# Altium schematic sheet jetson_nano_breakout.SchDoc: CAN Bus HAT
size B; Date: 12/22/2022; Author: Cole Tucker; Organization: ORGANIZATION; Address1: ADDRESS 1; Address2: ADDRESS 2; Address3: ADDRESS 3; Address4: ADDRESS 4; Revision: -; SheetNumber: 1; SheetTotal: 1; ENG_APP_DATE: --/--/--; DSN_APP_DATE: --/--/--; CHK_APP_DATE: --/--/--
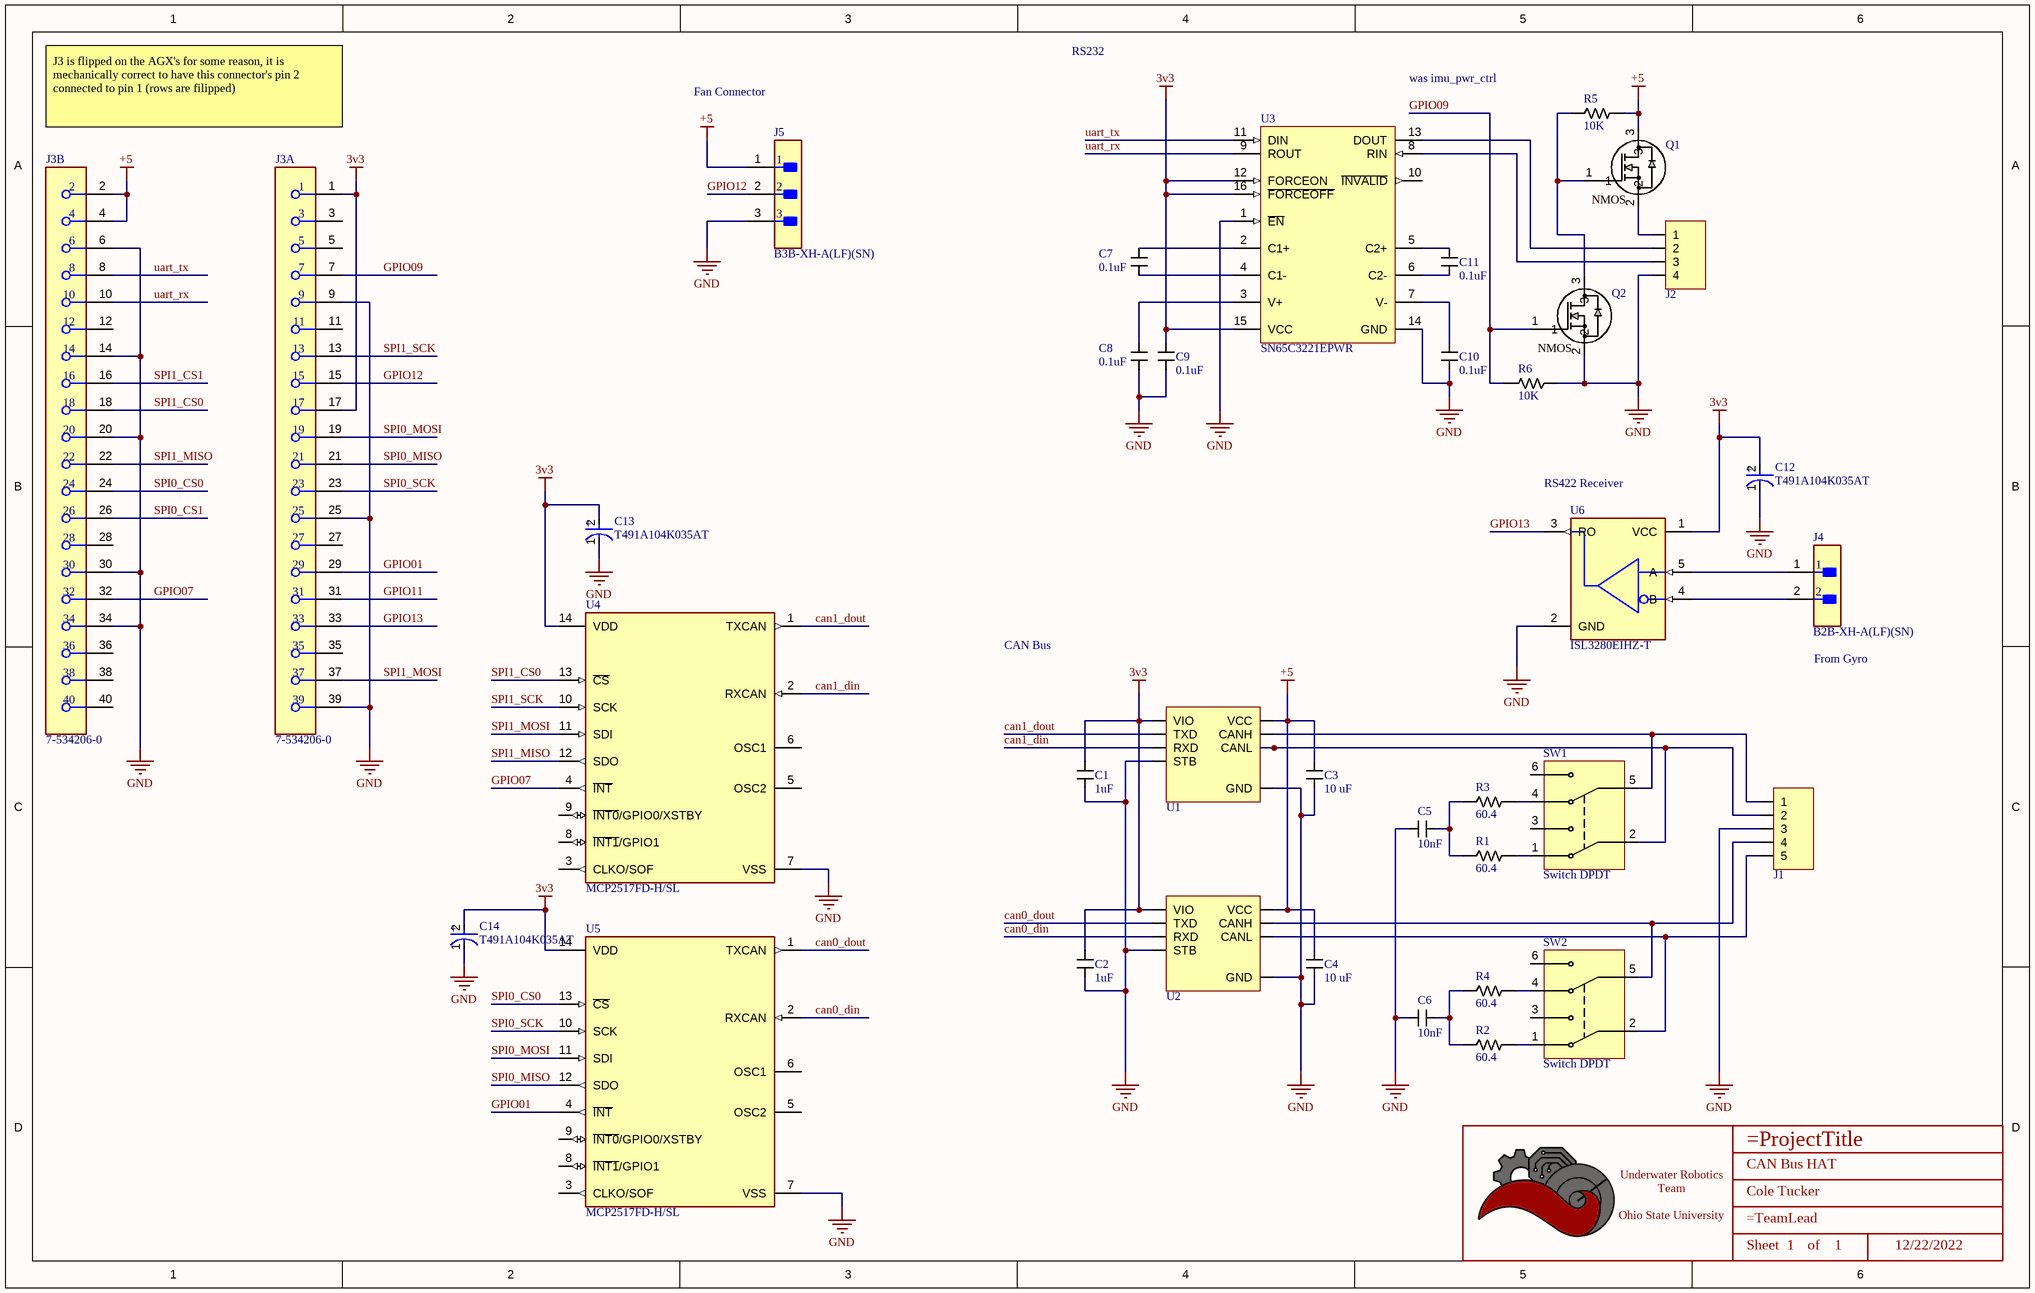
[diagram p0: jetson_nano_breakout.SchDoc]

## Parts
*  Title_Block  [LOGO]  (value not drawn)  (graphical)
C1  value 1uF  [CAPACITOR_0603]  (hidden comment: 1uF Ceramic 16V)
C2  value 1uF  [CAPACITOR_0603]  (hidden comment: 1uF Ceramic 16V)
C3  Value (uF): 10 uF  [CAPACITOR_0603]  (hidden comment: 10uF Ceramic 6.3V)
C4  Value (uF): 10 uF  [CAPACITOR_0603]  (hidden comment: 10uF Ceramic 6.3V)
C5  value 10nF  [CAPACITOR_0603]  (hidden comment: 10nF Ceramic 6.3V)
C6  value 10nF  [CAPACITOR_0603]  (hidden comment: 10nF Ceramic 6.3V)
C7  value 0.1uF  [CAPACITOR_0603]  (hidden comment: 100nF Ceramic 6.3V)
C8  value 0.1uF  [CAPACITOR_0603]  (hidden comment: 100nF Ceramic 6.3V)
C9  value 0.1uF  [CAPACITOR_0603]  (hidden comment: 100nF Ceramic 6.3V)
C10  value 0.1uF  [CAPACITOR_0603]  (hidden comment: 100nF Ceramic 6.3V)
C11  value 0.1uF  [CAPACITOR_0603]  (hidden comment: 100nF Ceramic 6.3V)
C12  T491A104K035AT  [FP-T491A104K035AT-MFG]
C13  T491A104K035AT  [FP-T491A104K035AT-MFG]
C14  T491A104K035AT  [FP-T491A104K035AT-MFG]
J1  XH2.54 VERT  [CONN_JST_XH254_5POS_VERT]  (value not drawn)
J2  XH2.54 VERT  [CONN_JST_XH254_4POS_VERT]  (value not drawn)
J3  7-534206-0  [FP-7-534206-0-MFG]  (parts A,B of 2)
J4  B2B-XH-A(LF)(SN)  [FP-B2B-XH-A_LF_SN-MFG]
J5  B3B-XH-A(LF)(SN)  [FP-B3B-XH-A_LF_SN-MFG]
Q1  MOSFET N-CH 30V 5.8A SOT-23-3  [SOT-23-3]  (value not drawn)
Q2  MOSFET N-CH 30V 5.8A SOT-23-3  [SOT-23-3]  (value not drawn)
R1  Value  (Ohms): 60.4  [RESISTOR_0402]  (hidden comment: 60.4 Ohm 1% 1/16W)
R2  Value  (Ohms): 60.4  [RESISTOR_0402]  (hidden comment: 60.4 Ohm 1% 1/16W)
R3  Value  (Ohms): 60.4  [RESISTOR_0402]  (hidden comment: 60.4 Ohm 1% 1/16W)
R4  Value  (Ohms): 60.4  [RESISTOR_0402]  (hidden comment: 60.4 Ohm 1% 1/16W)
R5  Value  (Ohms): 10K  [RESISTOR_0603]  (hidden comment: 10k Ohm 5% 1/10W)
R6  Value  (Ohms): 10K  [RESISTOR_0603]  (hidden comment: 10k Ohm 5% 1/10W)
SW1  Switch DPDT  [CAS-220TA]
SW2  Switch DPDT  [CAS-220TA]
U1  CAN Transceiver  [SOIC-8]  (value not drawn)
U2  CAN Transceiver  [SOIC-8]  (value not drawn)
U3  SN65C3221EPWR  [PW0016A_M]
U4  MCP2517FD-H/SL  [FP-C04-065-SL-MFG]
U5  MCP2517FD-H/SL  [FP-C04-065-SL-MFG]
U6  ISL3280EIHZ-T  [FP-P5_064-MFG]

## Nets
3v3: C1.1 C2.1 C9.1 C12.2(A) C13.2(A) C14.2(A) J3.1 J3.17 U1.5(VIO) U2.5(VIO) U3.12(FORCEON) U3.15(VCC) U3.16(~{FORCEOFF}) U4.14(VDD) U5.14(VDD) U6.1(VCC)
+5: C3.1 C4.1 J3.2 J3.4 J5.1 Q1.3 R5.1 U1.3(VCC) U2.3(VCC)
GND: C1.2 C2.2 C3.2 C4.2 C5.1 C6.1 C8.2 C9.2 C10.2 C12.1(C) C13.1(C) C14.1(C) J1.3 J2.4 J3.6 J3.9 J3.14 J3.20 J3.25 J3.30 J3.34 J3.39 J5.3 Q2.2 R6.2 U1.2(GND) U1.8(STB) U2.2(GND) U2.8(STB) U3.1(~{EN}) U3.14(GND) U4.7(VSS) U5.7(VSS) U6.2(GND)
can0_din: U2.4(RXD) U5.2(RXCAN)
can0_dout: U2.1(TXD) U5.1(TXCAN)
can1_din: U1.4(RXD) U4.2(RXCAN)
can1_dout: U1.1(TXD) U4.1(TXCAN)
GPIO01: J3.29 U5.4(~{INT})
GPIO07: J3.32 U4.4(~{INT})
GPIO09: J3.7 Q2.1 R6.1
GPIO11: J3.31
GPIO12: J3.15 J5.2
GPIO13: J3.33 U6.3(RO)
SPI0_CS0: J3.24 U5.13(~{CS})
SPI0_CS1: J3.26
SPI0_MISO: J3.21 U5.12(SDO)
SPI0_MOSI: J3.19 U5.11(SDI)
SPI0_SCK: J3.23 U5.10(SCK)
SPI1_CS0: J3.18 U4.13(~{CS})
SPI1_CS1: J3.16
SPI1_MISO: J3.22 U4.12(SDO)
SPI1_MOSI: J3.37 U4.11(SDI)
SPI1_SCK: J3.13 U4.10(SCK)
uart_rx: J3.10 U3.9(ROUT)
uart_tx: J3.8 U3.11(DIN)
NetC5_2: C5.2 R1.2 R3.2
NetC6_2: C6.2 R2.2 R4.2
NetC7_1: C7.1 U3.2(C1+)
NetC7_2: C7.2 U3.4(C1-)
NetC8_1: C8.1 U3.3(V+)
NetC10_1: C10.1 U3.7(V-)
NetC11_1: C11.1 U3.5(C2+)
NetC11_2: C11.2 U3.6(C2-)
NetJ1_1: J1.1 SW1.5 U1.7(CANH)
NetJ1_2: J1.2 SW1.2 U1.6(CANL)
NetJ1_4: J1.4 SW2.5 U2.7(CANH)
NetJ1_5: J1.5 SW2.2 U2.6(CANL)
NetJ2_1: J2.1 Q1.2
NetJ2_2: J2.2 U3.13(DOUT)
NetJ2_3: J2.3 U3.8(RIN)
NetJ4_1: J4.1 U6.5(A)
NetJ4_2: J4.2 U6.4(B)
NetQ1_1: Q1.1 Q2.3 R5.2
NetR1_1: R1.1 SW1.1
NetR2_1: R2.1 SW2.1
NetR3_1: R3.1 SW1.4
NetR4_1: R4.1 SW2.4

Not connected (* = marked no-connect by the designer): J3 3 5 11 12 27 28 35 36 38 40; SW1 3 6; SW2 3 6; U3 10(~{INVALID}); U4 3(CLKO/SOF) 5(OSC2) 6(OSC1) 8(~{INT1}/GPIO1) 9(~{INT0}/GPIO0/XSTBY); U5 3(CLKO/SOF) 5(OSC2) 6(OSC1) 8(~{INT1}/GPIO1) 9(~{INT0}/GPIO0/XSTBY)

## Notes on the sheet
- Fan Connector
- RS232
- was imu_pwr_ctrl
- J3 is flipped on the AGX's for some reason, it is mechanically correct to have this connector's pin 2 connected to pin 1 (rows are filipped)
- (near U6) RS422 Receiver
- CAN Bus
- From Gyro
- DWG. NO.
- REV.
- SHT.
- THIS DOCUMENT AND THE DATA DISCLOSED HEREIN OR HEREWITH IS THE PROPERTY OF ALTIUM LIMITED AND MAY BE FREELY DISTRIBUTED IN WHOLE. NO RIGHTS ARE RESERVED OR EXPRESS OR IMPLIED WARANTEE GIVEN.
- REVISION
- DESCRIPTION
- DATE
- APPROVED
- ENG:
- APPROVALS
- PROJECT
- DSN:
- CHK:
- REFERENCE DOCUMENTS
- PROJECT REVISION:
- TITLE
- DOCUMENT REVISION:
- DESIGN ITEM:
- BOM:
- FAB DWG:
- PCB DWG:
- ASSY DWG:
- SCALE:
- SIZE
- B
- CAGE CODE
- FILE NAME
- DWG NO.
- SHEET
- OF
- REV
- (in symbol AO3404A) NMOS
- (in symbol CMP-03017-000018-1) +
- (in symbol Title_Block) Underwater Robotics Team / Ohio State University; Sheet; of

## Library data of the parts
* = Title_Block: UWRT Schematic Title Block Template / Created June 2021, Dylan Trainor
C1 C2 = CAPACITOR_1uF_0603: Cap 1uF 16V +/-10% / Ceramic 0603; Made By: Flip B; Tolerance: +/- 10%; Voltage: 16V; Supplier 1: Digi-Key; Supplier Part Number 1: 399-7847-1-ND
C3 C4 = CAPACITOR_10uF_0603: Cap 10uF 6.3V +/-20% / Ceramic 0603; Made By: Flip B; ComponentLink1Description: Digikey; ComponentLink1URL: https://www.digikey.com/en/products/detail/samsung-electro-mechanics/CL10A106MQ8NNNC/3886777; Supplier 1: Digi-Key; Supplier Part Number 1: 1276-1119-1-ND; Tolerance: +/- 20%; Voltage: 6.3V
C5 C6 = CAPACITOR_0.01uF_0603: Cap 10nF 6.3V +/-20% / Ceramic 0603; Tolerance: +/- 10%; Made By: Flip B; ComponentLink1Description: Datsheet; ComponentLink1URL: https://www.mouser.com/datasheet/2/212/KEM_C1002_X7R_SMD-1102033.pdf; Voltage: 6.3V; Supplier 1: Mouser; Supplier Part Number 1: 80-C0603C103K9R
C7-C11 = CAPACITOR_0.1uF_0603: Cap 100nF 6.3V +/-10% / Ceramic 0603; Made By: Flip B; ComponentLink1Description: Datsheet; ComponentLink1URL: https://www.mouser.com/datasheet/2/212/KEM_C1002_X7R_SMD-1102033.pdf; Tolerance: +/- 10%; Voltage: 6.3V; Supplier 1: Digi-Key; Supplier Part Number 1: 399-15351-1-ND
C12-C14 = CMP-03017-000018-1: CAP TANT 0.1UF 10% 35V 1206; Dissipation Factor: 4%; ESR (Equivalent Series Resistance): 20R; Polarity: Polar; Dielectric Material: Tantalum; Leakage Current: 500nA; Ripple Current: 61mA; Life (Hours): 2000Hour; Capacitance: 100nF; Width: 1.6mm; Radiation Hardening: No; Lead Free: Lead Free; Case Code (Metric): 3216; REACH SVHC: No SVHC; Termination: SMD/SMT; Tolerance: 10%; Height - Seated (Max): 0.071inch; Series: T491; Features: General Purpose; Lead Pitch: 1.2mm; RoHS Compliant: Yes; Number of Pins: 2; Voltage: 35V; Packaging: Tape and Reel; Depth: 1.6mm; Length: 3.2mm; Case Code (Imperial): 1206; Construction: Flat; Min Operating Temperature: -55°C; Max Operating Temperature: 125°C; Height: 1.6mm; Voltage Rating: 35V; Case/Package: 1206; Package Quantity: 1; Weight: 0.000571oz; Size: 1.6mm; Voltage Rating (DC): 35V; Mount: Surface Mount
J1 = CONN_JST_XH254_5POS_VERT: JST XH 2.54mm Pitch 5 Pos Vertical; Current Per Pin: 4A; Number of Positions: 5; NOTE: Do not use JST 2.5mm parts with this footprint. JST does not make 2.54mm pitch pins, rather only clones make this connector!; Manufacturer: JST; Pitch: 2.54mm; Configuration: Vertical; Color: White; Created By: Robert P; Series: XH 2.54; ComponentLink1Description: Purchase Link; ComponentLink1URL: https://www.amazon.com/460PCS-XH2-54-Connector-Terminal-Connectors/dp/B09DBGVX5C
J2 = CONN_JST_XH254_4POS_VERT: JST XH 2.54mm Pitch 4 Pos Vertical; Current Per Pin: 4A; Number of Positions: 4; NOTE: Do not use JST 2.5mm parts with this footprint. JST does not make 2.54mm pitch pins, rather only clones make this connector!; Manufacturer: JST; Pitch: 2.54mm; Configuration: Vertical; Color: White; Created By: Robert P; Series: XH 2.54; ComponentLink1Description: Purchase Link; ComponentLink1URL: https://www.amazon.com/460PCS-XH2-54-Connector-Terminal-Connectors/dp/B09DBGVX5C
J3 = CMP-03369-000068-1: CONN RCPT 40POS 0.1 GOLD PCB; Manufacturer: TE Connectivity; Standoff Height: 0.38mm; Voltage Rating: 333V; Conn Orientation: Vertical; Is Female: yes; Pitch: 2.54mm; Number Of Contacts: 40; Current Rating: 2A; Conn Gender: Female; Temperature: -65°C to +105°C; Temperature Range High: +105°C; Temperature Range Low: -65°C; Package: 7-534206-0; Lead Free: Yes; Manufacturer Part Number: 7-534206-0; Contact Material: Gold,Nickel; Device Class L2: Headers and Wire Housings; RoHS: TRUE; Number Of Rows: 2; Octopart: https://octopart.com/7-534206-0-te+connectivity-39516831; Device Class L3: unset; Device Class L1: Connectors; Mouser Description: Headers & Wire Housings REC 2X20P VRT T/H; ComponentLink2URL: https://octopart.com/datasheet/7-534206-0-te+connectivity-39516831; ComponentLink2Description: Datasheet; Digikey Description: CONN RCPT 40POS 0.1 GOLD PCB; Footprint Url: https://www.mouser.in/datasheet/2/418/NG_CD_534206_R7-1252933.pdf; Category: Conn; Height: 8.9mm; Automotive: No
J4 = CMP-2000-05888-3: CONN HEADER VERT 2POS 2.5MM; Current Rating: 3A; Voltage Rating: 250V; Number of Contacts: 2; Contact Resistance: 20mR; Wire/Cable Gauge: 22AWG; Insulation Resistance: 1GR; Connector Type: Male Pin; Packaging: Bulk; Contact Material: Brass; Lead Free: Lead Free; Orientation: Straight; Contact Plating: Tin; Max Current Rating: 3A; Termination: Solder; Fastening Type: Detent; Depth: 5.75mm; Housing Material: Polyamide; REACH SVHC: No SVHC; Series: XH; Voltage Rating (AC): 250V; Number of Positions: 2; Color: Natural; Contact Type: Male Pin; Max Voltage Rating (DC): 250V; Pitch: 2.5mm; Lead Pitch: 2.5mm; Mount: Through Hole; Max Operating Temperature: 85°C; Length: 7.4mm; Max Voltage Rating (AC): 250V; Min Operating Temperature: -25°C; Number of Rows: 1; Housing Color: White
J5 = CMP-17439-000014-3: CONN HEADER VERT 3POS 2.5MM; Max Voltage Rating (DC): 250V; Number of Positions: 3; Current Rating: 3A; Gender: Male; Wire/Cable Gauge: 22AWG; Contact Resistance: 20mR; Insulation Resistance: 1GR; Insulation Material: Nylon; Contact Plating: Tin; Depth: 5.75mm; Contact Type: Male Pin; Max Operating Temperature: 85°C; Insulation Color: Natural; Voltage Rating (AC): 250V; Color: Natural; Connector Type: Header; Orientation: Straight; Fastening Type: Detent; Housing Color: White; Min Operating Temperature: -25°C; Termination: Solder; Voltage Rating: 250V; Series: XH; Pitch: 2.5mm; Contact Shape: Square; Number of Rows: 1; Lead Free: Lead Free; Packaging: Bulk; Mount: Through Hole; Flammability Rating: UL94 V-0; Max Voltage Rating (AC): 250V; REACH SVHC: No SVHC; Housing Material: Polyamide; Contact Material: Brass; Lead Pitch: 2.5mm; Contact Finish - Mating: TIN; Length: 9.9mm; Max Current Rating: 3A; Number of Contacts: 3
Q1 Q2 = AO3404A: N-Channel 30 V 5.8A (Ta) 1.4W (Ta) Surface Mount SOT-23-3; Vendor: Alpha & Omega Semiconductor Inc.; SourceLibrary: ON_Semiconductor_2020-01-13; Vgs (Max): 3V @ 5.8A, 10V; Vgs (th): 3V @ 250µA; Rds (on): 28mOhm @ 5.8A, 10V; Amp Rating: 5.8 A; FET Type: N-Channel; Package: SOT23-3L; Manufacturer _Part_Number: AO3404A; Vdss: 30V; Power Dissipation: 1.4W (Ta); Supplier 1: Digi-Key; Supplier Part Number 1: 785-1004-1-ND; Created By: Dylan T
R1-R4 = RESISTOR_60.4_0402: RES 60.4 OHM 1% 1/16W 0402; Tolerance: +/- 1%; Made By: Robert Pafford; Wattage: 1/16W; Supplier: Digikey; Digikey Part Numer: CR0603-JW-104ELFTR-ND; Supplier 1: Digi-Key; Supplier Part Number 1: 13-AC0402FR-0760R4LCT-ND
R5 R6 = RESISTOR_10K_0603: RES 10k OHM 5% 1/10W 0603; Tolerance: +/- 5%; Wattage: 1/8W; Made By: Robert Pafford; ComponentLink1Description: Datasheet; ComponentLink1URL: https://www.bourns.com/docs/product-datasheets/CRxxxxx.pdf; Supplier: Digikey; Digikey Part Numer: CR0603-JW-104ELFTR-ND; Supplier 1: Digi-Key; Supplier Part Number 1: 2019-RK73B1JTTD103JCT-ND
SW1 SW2 = CAS-220TA_CAN_TERM: GOLD SWITCH FLUSH SLIDE DPDT 100MA 6V; Made By: Robert Pafford; Voltage Rating: 6VDC; Current Rating: 100 mA; Switch Function: DPDT; Contact Finish: Gold; Supplier 1: Digi-Key; Supplier Part Number 1: CAS220JCT-ND
U1 U2 = TJA1442AT: CAN Interface IC High-Speed CAN Transceiver with Standby Mode; Made By: Robert Pafford; Max Data Rate: 5Mbps; Supplier 1: Mouser; Supplier Part Number 1: 771-TJA1442AT/0Z
U3 = CMP-0299-01595-2: 3-V to 5.5-V Single-Channel RS-232 1-Mbit/s Line Driver / Receiver with ±15-kV IEC ESD Protection, -40 to 85 degC, 16-Pin SSOP (DB), Green (RoHS & no Sb/Br); ICC(Max)(mA): 1; ESD HBM(kV): +/-15; Single Supply: TRUE; Supply Voltage(s)(V): 3.3 or 5.0; PackageVersion: revG, Feb-2011; PackageReference: PW0016A; ComponentLink3Description: Package Specification; Drivers Per Package: 1; ComponentLink3URL: http://www.ti.com/litv/pdf/mpds361; Receivers Per Package: 1; IEC-61000-4-2 SUPPORT: TRUE; SubFamily: RS-232; ComponentLink1Description: Manufacturer URL; DatasheetVersion: SLLS694B; ComponentLink2Description: Datasheet; ComponentLink2URL: http://www.ti.com/general/docs/lit/getliterature.tsp?genericPartNumber=SN65C3221E&fileType=pdf; ComponentLink1URL: www.ti.com; RS-232: TRUE; PackageDescription: 16-Pin Plastic Thin Small Outline Package 5 x 4.4 mm Body ,0.65 mm Pitch
U4 U5 = CMP-06298-000003-1: IC CANBUS CONTROLLER SPI 14SOIC; Manufacturer: Microchip; Interface: SPI,CAN; Nominal Supply Current: 15mA; Description: CANbus Controller CAN 2.0 SPI Interface 14-SOIC; Max Supply Voltage: 5.5V; Min Supply Voltage: 2.7V; Max Junction Temp: +165°C; Standoff Height: 0.1mm; ComponentLink2URL: http://ww1.microchip.com/downloads/en/DeviceDoc/MCP2517FD-External-CAN-FD-Controller-with-SPI-Interface-20005688B.pdf; ComponentLink2Description: Datasheet; Device Class L2: Interface ICs; Temperature Range Low: -40°C; Category: IC; Manufacturer Part Number: MCP2517FD-H/SL; Digikey Description: IC CANBUS CONTROLLER SPI 14SOIC; Ambient Temperature Range High: +150°C; Footprint Url: http://ww1.microchip.com/downloads/en/DeviceDoc/14L%20SOIC%203_90%20mm%20%28SL%29%20C04-00065d.pdf; Mouser Description: Stand-Alone Can Fd Controller w/Spi Interface, 14 Soic .150in Tube; Function: Controller; Device Class L3: Controllers; Ambient Temperature Range Low: -40°C; Octopart: https://octopart.com/mcp2517fd-h%2Fsl-microchip-83497369; Package: C04-065-SL; Temperature: -40°C to +150°C; Automotive: No; Ipc Land Pattern Name: SOIC127P600X175-14; Device Class L1: Integrated Circuits (ICs); RoHS: TRUE; Lead Free: Yes; Height: 1.75mm; Temperature Range High: +150°C
U6 = CMP-13518-000001-1: IC RCVR ESD RS485/422 LP SOT23-5; Manufacturer: Renesas; Max Junction Temp: +150°C; Min Supply Voltage: 3V; Nominal Supply Current: 400uA; Number Of Receivers: 1; Max Supply Voltage: 5.5V; Simplex Duplex: Simplex; Standoff Height: 0mm; Interface: RS-485,RS-422; Data Rate: 20Mbits/s; Device Class L3: RS-232 / RS-422 / RS-485 Interface ICs; ComponentLink2URL: https://www.renesas.com/us/en/www/doc/datasheet/isl3280e-81e-82e-83e-84e-85e.pdf; Mouser Description: ISL3280E Series 20 Mbps ±16.5 kV Surface Mount RS-485/RS-422 Receiver - SOT-23-5; Ipc Land Pattern Name: SOT95P280X118-5; Temperature: -40°C to +85°C; Lead Free: Yes; Device Class L2: Interface ICs; RoHS: TRUE; Device Class L1: Integrated Circuits (ICs); Octopart: https://octopart.com/isl3280eihz-t-renesas-88254858; Automotive: No; Height: 1.45mm; ComponentLink2Description: Datasheet; Manufacturer Part Number: ISL3280EIHZ-T; Category: IC; Package: P5.064; Temperature Range High: +85°C; Digikey Description: IC RCVR ESD RS485/422 LP SOT23-5; Temperature Range Low: -40°C